# EAGLE schematic rpi-adapter_V0 (EAGLE 9.2.2)
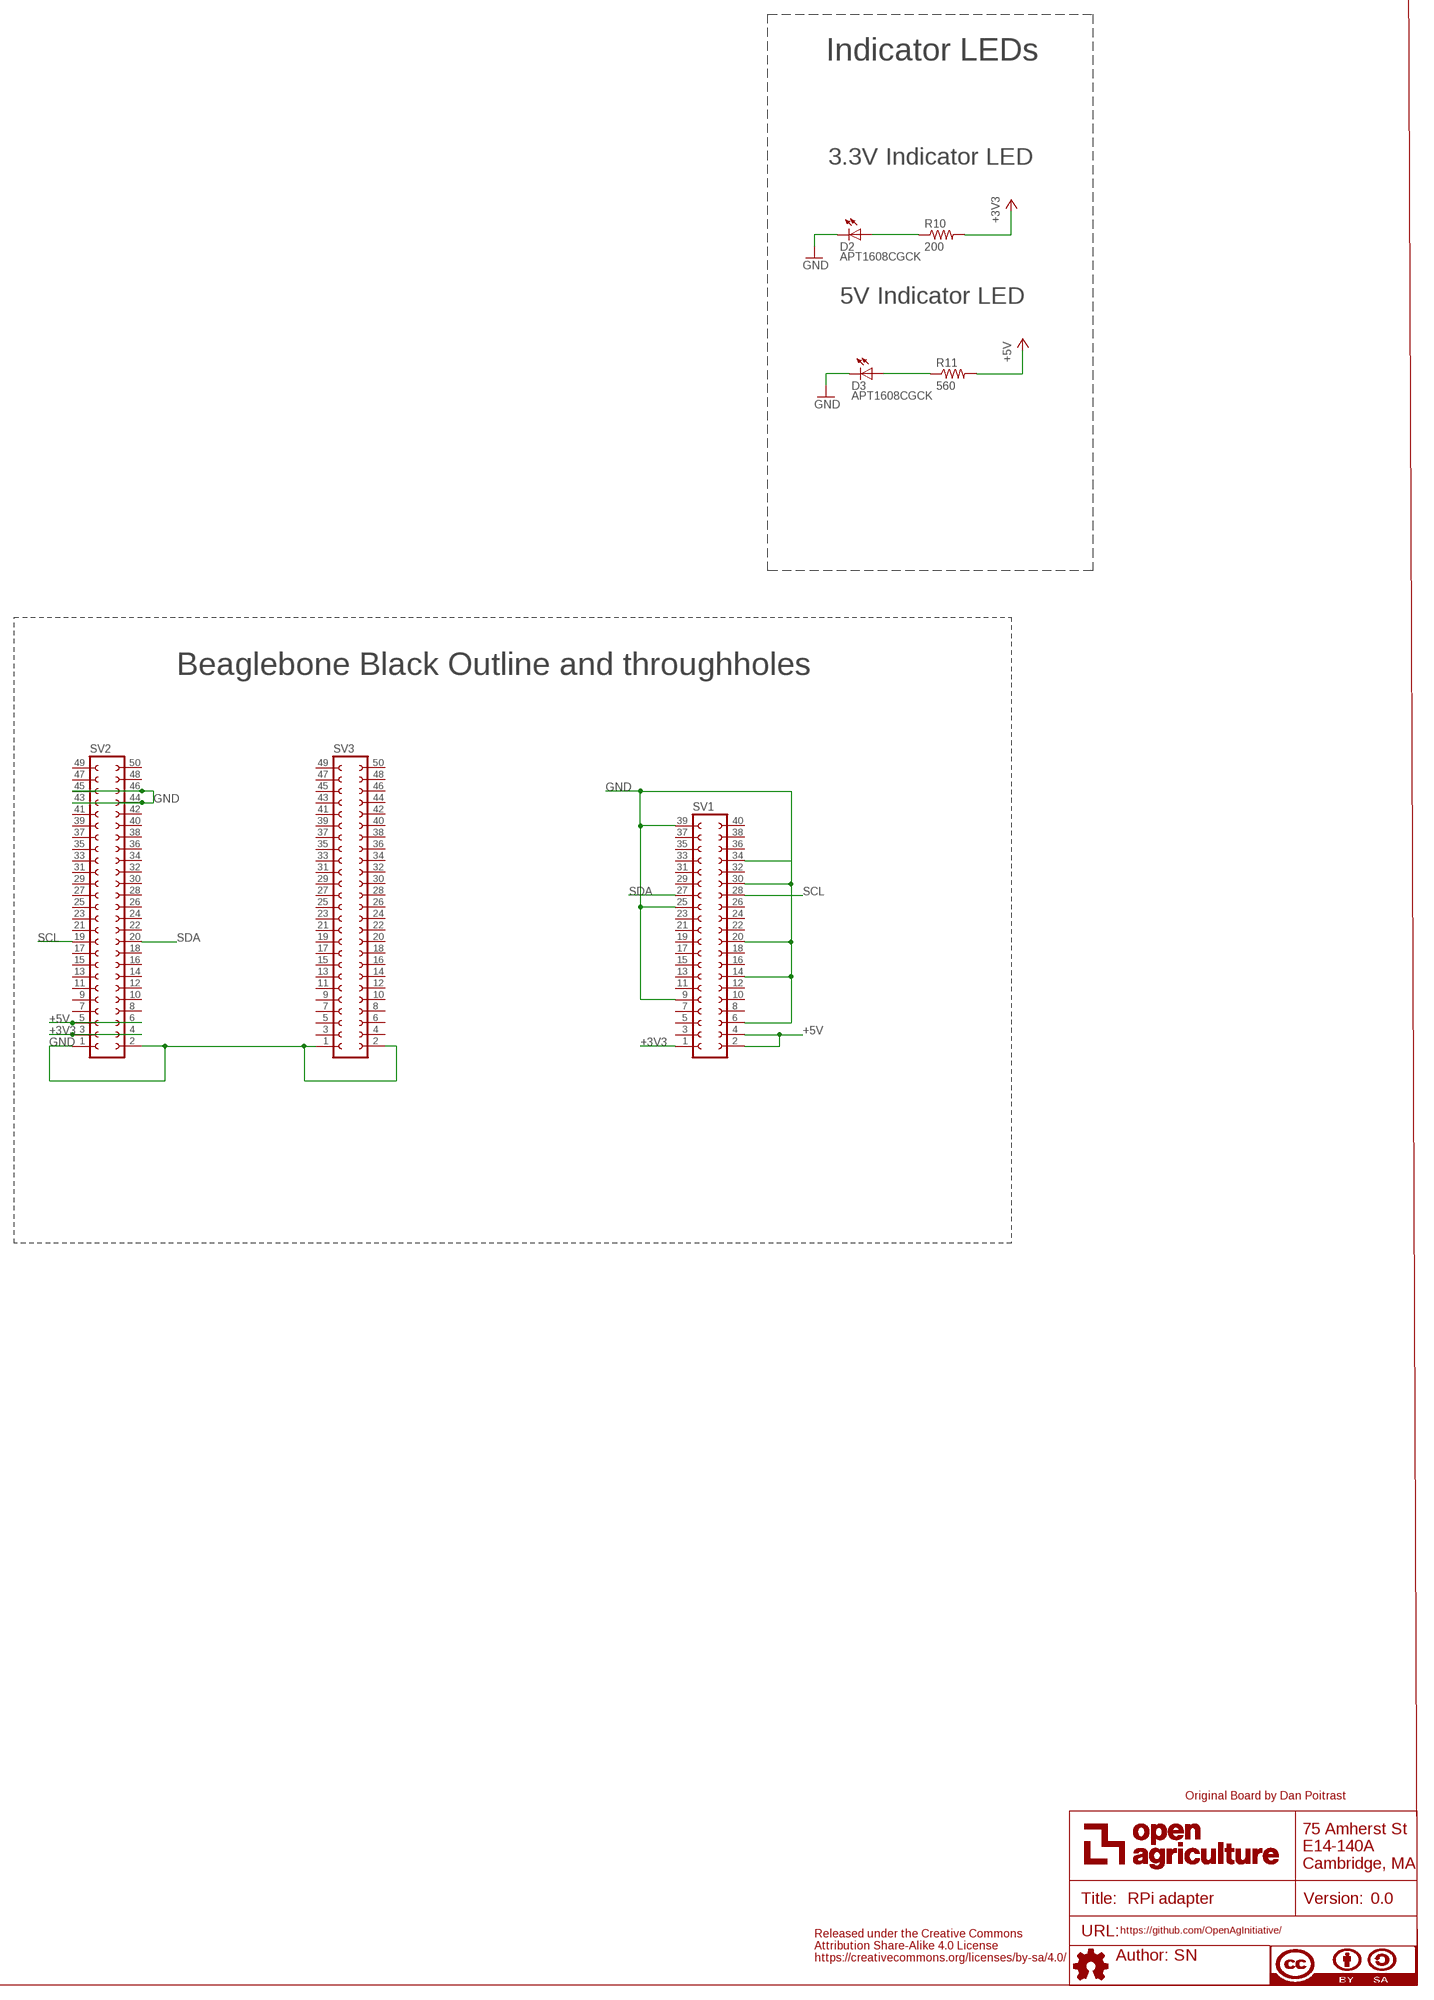
[diagram p0: schematic, sheet 1]

## Parts
ATTRIBUTES  DOCFIELD  [DOCFIELD]
D2  APT1608CGCK  [CHIPLED_0603]
D3  APT1608CGCK  [CHIPLED_0603]
R10  200  100OHM-RC0603JR-07100RL  [RC0603N]
R11  560  100OHM-RC0603JR-07100RL  [RC0603N]
SV1  FE20-2  [FE20-2]
SV2  FE25-2  [FE25-2]
SV3  FE25-2  [FE25-2]

## Nets
+3V3: R10.2 SV1.1 SV2.3 SV2.4
+5V: R11.2 SV1.2 SV1.4 SV2.5 SV2.6
GND: D2.C D3.C SV1.6 SV1.9 SV1.14 SV1.20 SV1.25 SV1.30 SV1.34 SV1.39 SV2.1 SV2.2 SV2.43 SV2.44 SV2.45 SV2.46 SV3.1 SV3.2
N$2: D3.A R11.1
N$12: D2.A R10.1
SCL: SV1.28 SV2.19
SDA: SV1.27 SV2.20
Unconnected: SV1.3 SV1.5 SV1.7 SV1.8 SV1.10 SV1.11 SV1.12 SV1.13 SV1.15 SV1.16 SV1.17 SV1.18 SV1.19 SV1.21 SV1.22 SV1.23 SV1.24 SV1.26 SV1.29 SV1.31 SV1.32 SV1.33 SV1.35 SV1.36 SV1.37 SV1.38 SV1.40 SV2.7 SV2.8 SV2.9 SV2.10 SV2.11 SV2.12 SV2.13 SV2.14 SV2.15 SV2.16 SV2.17 SV2.18 SV2.21 SV2.22 SV2.23 SV2.24 SV2.25 SV2.26 SV2.27 SV2.28 SV2.29 SV2.30 SV2.31 SV2.32 SV2.33 SV2.34 SV2.35 SV2.36 SV2.37 SV2.38 SV2.39 SV2.40 SV2.41 SV2.42 SV2.47 SV2.48 SV2.49 SV2.50 SV3.3 SV3.4 SV3.5 SV3.6 SV3.7 SV3.8 SV3.9 SV3.10 SV3.11 SV3.12 SV3.13 SV3.14 SV3.15 SV3.16 SV3.17 SV3.18 SV3.19 SV3.20 SV3.21 SV3.22 SV3.23 SV3.24 SV3.25 SV3.26 SV3.27 SV3.28 SV3.29 SV3.30 SV3.31 SV3.32 SV3.33 SV3.34 SV3.35 SV3.36 SV3.37 SV3.38 SV3.39 SV3.40 SV3.41 SV3.42 SV3.43 SV3.44 SV3.45 SV3.46 SV3.47 SV3.48 SV3.49 SV3.50

## Notes on the sheet
- Indicator LEDs
- 3.3V Indicator LED
- 5V Indicator LED
- Beaglebone Black Outline and throughholes
- Original Board by Dan Poitrast
- Released under the Creative Commons
  Attribution Share-Alike 4.0 License
  https://creativecommons.org/licenses/by-sa/4.0/

## Library data of the parts
ATTRIBUTES = openag-frames:DOCFIELD: DOCUMENT FIELD; AUTHOR: SN; DESCRIPTION: RPi to BBB adapter; TITLE: RPi adapter; URL: https://github.com/OpenAgInitiative/; VER: 0.0
D2 D3 = openag-diodes:APT1608CGCK: Kingbright - APT1608CGCK - LED GREEN CLEAR 0603 SMD Description: Green 570nm LED Indication - Discrete 2.1V 0603 (1608 Metric) Technical Specifications: Color: Green Lens Color: Colorless Lens Transparency: Clear Millicandela Rating: 50mcd Lens Style/Size: Rectangle with Flat Top, 1.20mm x 0.80mm Voltage - Forward (Vf) (Typ): 2.1V Current - Test: 20mA Viewing Angle: 120° Mounting Type: Surface Mount Wavelength - Dominant: 570nm Wavelength - Peak: 574nm Package / Case: 0603 (1608 Metric) Supplier Device Package: Chip LED Size / Dimension: 1.60mm L x 0.80mm W Height (Max): 0.75mm Datasheet(s): APT1608CGCK <http://www.kingbrightusa.com/images/catalog/SPEC/APT1608CGCK.pdf> Vendor(s): Digikey: 754-1116-1-ND <https://www.digikey.com/product-detail/en/kingbright/APT1608CGCK/754-1116-1-ND/1747833#>; POPULATE: YES; VERIFIED: NO
R10 R11 = openag-resistors:100OHM-RC0603JR-07100RL: Yageo - RC0603JR-07100RL - RES SMD 100 OHM 5% 1/10W 0603 Description: 100 Ohms ±5% 0.1W, 1/10W Chip Resistor 0603 (1608 Metric) Moisture Resistant Thick Film Technical Specifications: Resistance: 100 Ohms Tolerance: ±5% Power (Watts): 0.1W, 1/10W Composition: Thick Film Features: Moisture Resistant Temperature Coefficient: ±100ppm/°C Operating Temperature: -55°C ~ 155°C Package / Case: 0603 (1608 Metric) Supplier Device Package: 0603 Size / Dimension: 0.063" L x 0.032" W (1.60mm x 0.80mm) Height - Seated (Max): 0.022" (0.55mm) Number of Terminations: 2 Datasheet(s): Thick Film Chip Resistor Intro <http://www.yageo.com.tw/exep/pages/download/literatures/PYu-R_INT-thick_7.pdf> Chip Resistor Marking <http://www.yageo.com/exep/pages/download/literatures/PYu-R_Marking_2.pdf> RC Series, L Datasheet <http://www.yageo.com/documents/recent/PYu-RC_Group_51_RoHS_L_8.pdf> Vendor(s): Digikey: 311-100GRCT-ND <https://www.digikey.com/product-detail/en/yageo/RC0603JR-07100RL/311-100GRCT-ND/729644>; POPULATE: YES; VALUE: 100 OHM; VERIFIED: NO
SV1 = con-lsta:FE20-2: FEMALE HEADER; OC_FARNELL: unknown; OC_NEWARK: unknown
SV2 SV3 = con-lsta:FE25-2: FEMALE HEADER; OC_FARNELL: unknown; OC_NEWARK: unknown